# EAGLE design HackRPI-Badge (EAGLE 7.6.0)
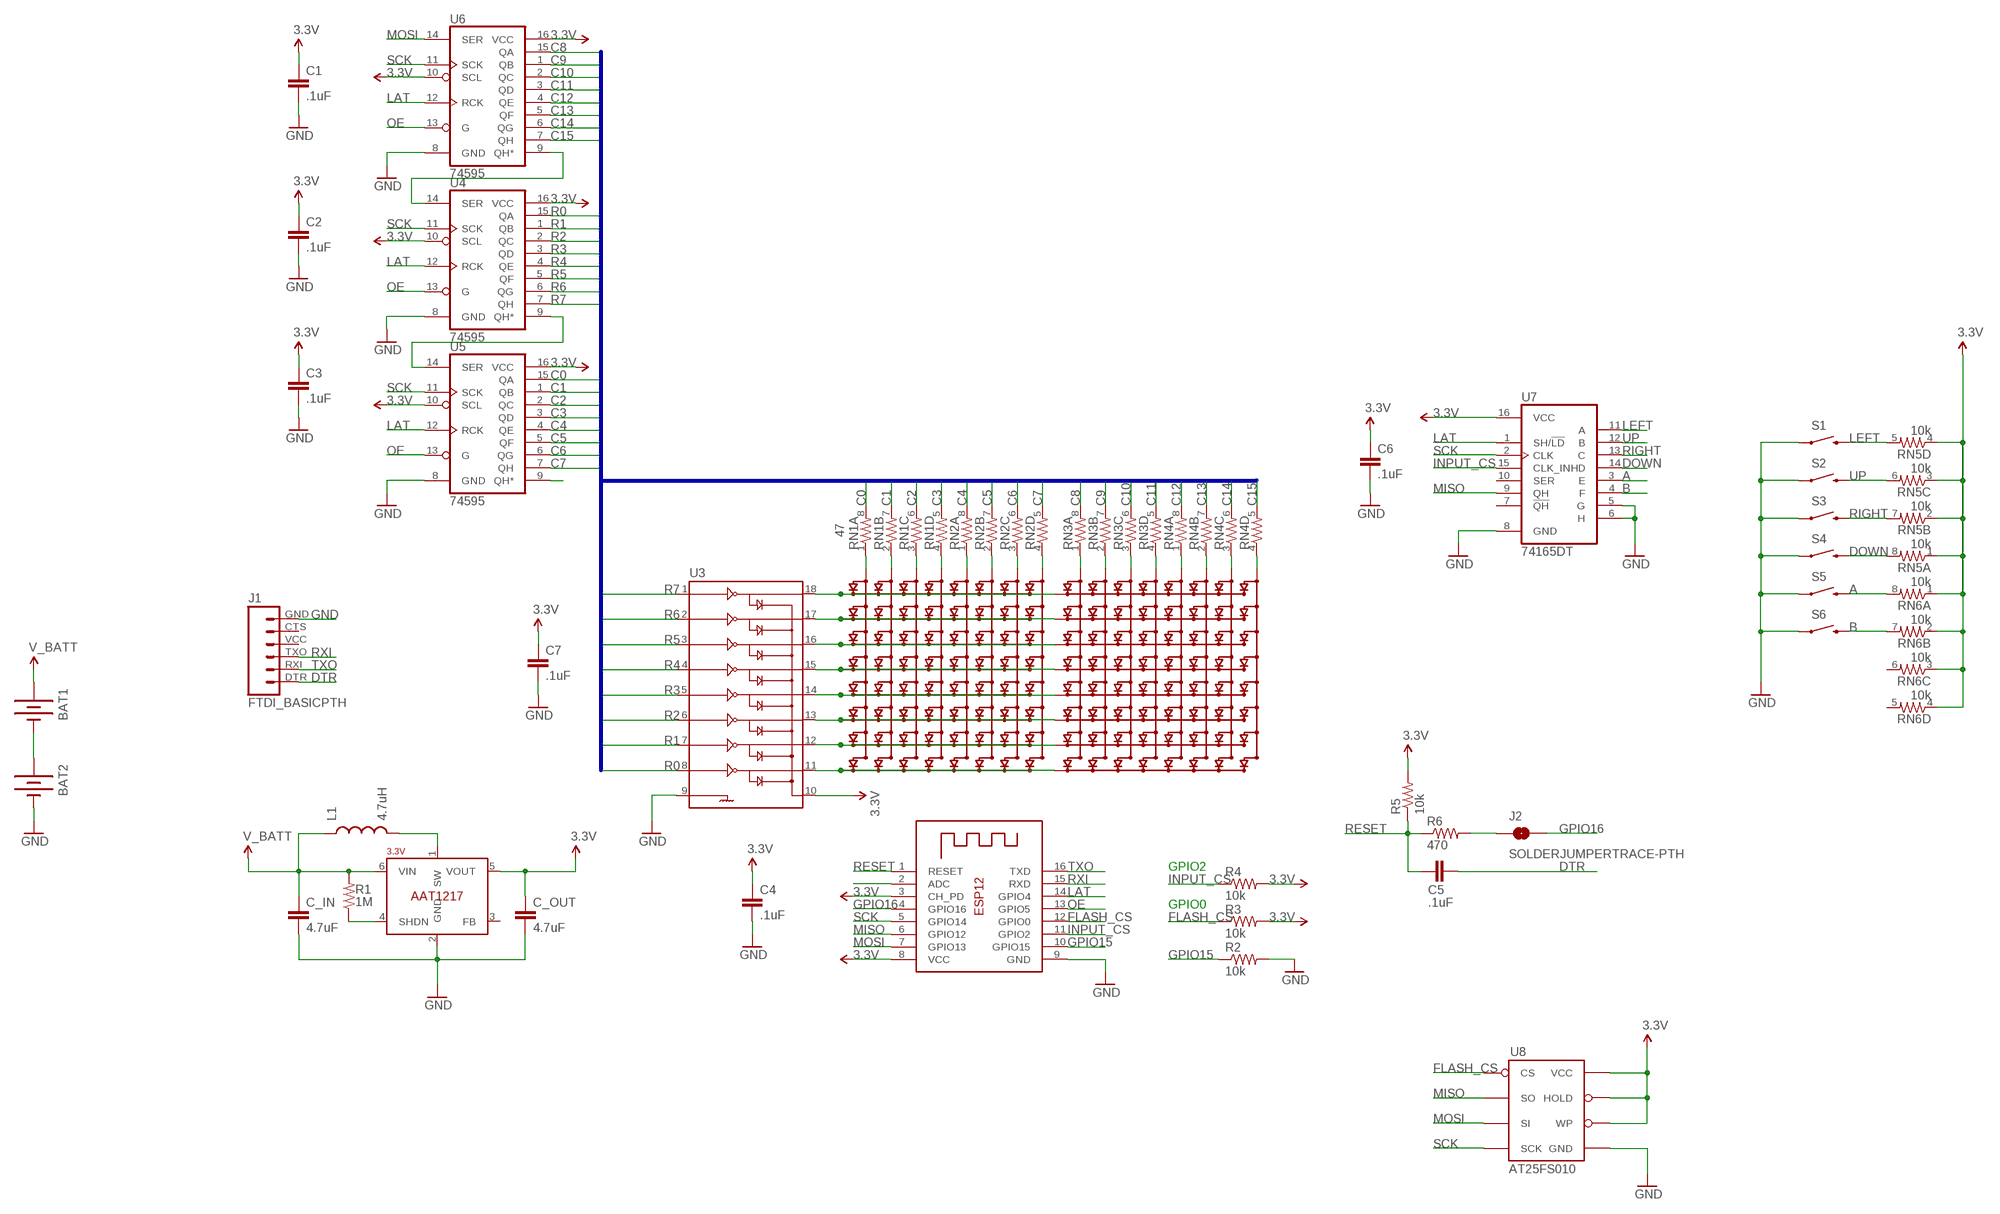
[diagram p0: schematic, sheet 1]

## Parts
BAT1  BATTERYAAA  [BATTERY-AAA]
BAT2  BATTERYAAA  [BATTERY-AAA]
C1  .1uF  CAP0603-CAP  [0603-CAP]
C2  .1uF  CAP0603-CAP  [0603-CAP]
C3  .1uF  CAP0603-CAP  [0603-CAP]
C4  .1uF  CAP0603-CAP  [0603-CAP]
C5  .1uF  CAP0603-CAP  [0603-CAP]
C6  .1uF  CAP0603-CAP  [0603-CAP]
C7  .1uF  CAP0603-CAP  [0603-CAP]
C_IN  4.7uF  CAP0805  [0805]
C_OUT  4.7uF  CAP0805  [0805]
J1  FTDI_BASICPTH  [FTDI_BASIC]
J2  SOLDERJUMPERTRACE-PTH  [SJ_2S-TRACE-PTH]
L1  4.7uH  INDUCTOR1007  [1007]
LED_LEFT  8X8LEDMATRIX_COLUMN_CATHODELDM-13488MI  [32MM_LEDMATRIX]
LEF_RIGHT  8X8LEDMATRIX_COLUMN_CATHODELDM-13488MI  [32MM_LEDMATRIX]
R1  1M  RESISTOR0603  [0603-RES]
R2  10k  RESISTOR0603  [0603-RES]
R3  10k  RESISTOR0603  [0603-RES]
R4  10k  RESISTOR0603  [0603-RES]
R5  10k  RESISTOR0603  [0603-RES]
R6  470  RESISTOR0603  [0603-RES]
RN1  47  RESISTOR-ARRAY0603-ARV  [0603-ARV]
RN2  47  RESISTOR-ARRAY0603-ARV  [0603-ARV]
RN3  47  RESISTOR-ARRAY0603-ARV  [0603-ARV]
RN4  47  RESISTOR-ARRAY0603-ARV  [0603-ARV]
RN5  10k  RESISTOR-ARRAY0603-ARV  [0603-ARV]
RN6  10k  RESISTOR-ARRAY0603-ARV  [0603-ARV]
S1  SWITCH-MOMENTARY-2PTH  [TACTILE-PTH]
S2  SWITCH-MOMENTARY-2PTH  [TACTILE-PTH]
S3  SWITCH-MOMENTARY-2PTH  [TACTILE-PTH]
S4  SWITCH-MOMENTARY-2PTH  [TACTILE-PTH]
S5  SWITCH-MOMENTARY-2PTH  [TACTILE-PTH]
S6  SWITCH-MOMENTARY-2PTH  [TACTILE-PTH]
U1  ESP-12  [ESP-12]
U2  3.3V  AAT1217  [SOT23-6]
U3  ULN2803SOICW  [SO18L]
U4  74595  [TSSOP16]
U5  74595  [TSSOP16]
U6  74595  [TSSOP16]
U7  74165DT  [TSSOP16]
U8  AT25FS010  [SO08WIDE]

## Nets
3.3V [power]: C1.1 C2.1 C3.1 C4.1 C6.1 C7.1 C_OUT.1 R3.2 R4.2 R5.2 RN5.1 RN5.2 RN5.3 RN5.4 RN6.1 RN6.2 RN6.3 RN6.4 U1.3(CH_PD) U1.8(VCC) U2.5(VOUT) U3.10 U4.10(SCL) U4.16(VCC) U5.10(SCL) U5.16(VCC) U6.10(SCL) U6.16(VCC) U7.16(VCC) U8.3(WP) U8.7(HOLD) U8.8(VCC)
A: RN6.8 S5.3 U7.3(E)
B: RN6.7 S6.3 U7.4(F)
C0: RN1.8 U5.15(QA)
C1: RN1.7 U5.1(QB)
C2: RN1.6 U5.2(QC)
C3: RN1.5 U5.3(QD)
C4: RN2.8 U5.4(QE)
C5: RN2.7 U5.5(QF)
C6: RN2.6 U5.6(QG)
C7: RN2.5 U5.7(QH)
C8: RN3.8 U6.15(QA)
C9: RN3.7 U6.1(QB)
C10: RN3.6 U6.2(QC)
C11: RN3.5 U6.3(QD)
C12: RN4.8 U6.4(QE)
C13: RN4.7 U6.5(QF)
C14: RN4.6 U6.6(QG)
C15: RN4.5 U6.7(QH)
DOWN: RN5.8 S4.3 U7.14(D)
DTR: C5.2 J1.DTR
FLASH_CS: R3.1 U1.12(GPIO0) U8.1(CS)
GND [power]: BAT2.GND@1(-) C1.2 C2.2 C3.2 C4.2 C6.2 C7.2 C_IN.2 C_OUT.2 J1.GND R2.2 S1.1 S2.1 S3.1 S4.1 S5.1 S6.1 U1.9(GND) U2.2(GND) U3.9 U4.8(GND) U5.8(GND) U6.8(GND) U7.5(G) U7.6(H) U7.8(GND) U8.4(GND)
GPIO15: R2.1 U1.10(GPIO15)
GPIO16: J2.2 U1.4(GPIO16)
INPUT_CS: R4.1 U1.11(GPIO2) U7.15(CLK_INH)
LAT: U1.14(GPIO4) U4.12(RCK) U5.12(RCK) U6.12(RCK) U7.1(SH/!LD)
LEFT: RN5.5 S1.3 U7.11(A)
MISO: U1.6(GPIO12) U7.9(QH) U8.2(SO)
MOSI: U1.7(GPIO13) U6.14(SER) U8.5(SI)
N$1: J2.1 R6.2
N$2: U1.2(ADC)
N$3: LED_LEFT.13(C1) RN1.1
N$4: LED_LEFT.3(C2) RN1.2
N$5 [power]: L1.2 U2.1(SW)
N$6: R1.1 U2.4(SHDN)
N$7: LED_LEFT.9(R1) LEF_RIGHT.9(R1) U3.18
N$8: LED_LEFT.4(C3) RN1.3
N$9: LED_LEFT.10(C4) RN1.4
N$10: LED_LEFT.6(C5) RN2.1
N$11: LED_LEFT.11(C6) RN2.2
N$12: LED_LEFT.15(C7) RN2.3
N$13: LED_LEFT.16(C8) RN2.4
N$14: LED_LEFT.14(R2) LEF_RIGHT.14(R2) U3.17
N$15: LED_LEFT.8(R3) LEF_RIGHT.8(R3) U3.16
N$16: LED_LEFT.12(R4) LEF_RIGHT.12(R4) U3.15
N$17: LED_LEFT.1(R5) LEF_RIGHT.1(R5) U3.14
N$18: LED_LEFT.7(R6) LEF_RIGHT.7(R6) U3.13
N$19: LED_LEFT.2(R7) LEF_RIGHT.2(R7) U3.12
N$20: LED_LEFT.5(R8) LEF_RIGHT.5(R8) U3.11
N$21: U4.9(QH*) U5.14(SER)
N$22: U4.14(SER) U6.9(QH*)
N$23: LEF_RIGHT.13(C1) RN3.1
N$24: LEF_RIGHT.3(C2) RN3.2
N$25: LEF_RIGHT.4(C3) RN3.3
N$26: LEF_RIGHT.10(C4) RN3.4
N$27: LEF_RIGHT.6(C5) RN4.1
N$28: LEF_RIGHT.11(C6) RN4.2
N$29: LEF_RIGHT.15(C7) RN4.3
N$30: LEF_RIGHT.16(C8) RN4.4
N$31 [power]: BAT1.GND@1(-) BAT2.PWR@1(+)
N$33: U5.9(QH*)
OE: U1.13(GPIO5) U4.13(G) U5.13(G) U6.13(G)
R0: U3.8 U4.15(QA)
R1: U3.7 U4.1(QB)
R2: U3.6 U4.2(QC)
R3: U3.5 U4.3(QD)
R4: U3.4 U4.4(QE)
R5: U3.3 U4.5(QF)
R6: U3.2 U4.6(QG)
R7: U3.1 U4.7(QH)
RESET: C5.1 R5.1 R6.1 U1.1(RESET)
RIGHT: RN5.7 S3.3 U7.13(C)
RXI: J1.TXO U1.15(RXD)
SCK: U1.5(GPIO14) U4.11(SCK) U5.11(SCK) U6.11(SCK) U7.2(CLK) U8.6(SCK)
TXO: J1.RXI U1.16(TXD)
UP: RN5.6 S2.3 U7.12(B)
V_BATT [power]: BAT1.PWR@1(+) C_IN.1 L1.1 R1.2 U2.6(VIN)
Unconnected: J1.CTS J1.VCC RN6.5 RN6.6 U2.3(FB) U7.7(!QH) U7.10(SER)

## Buses
R[0..7],C[0..15]

## Notes on the sheet
- GPIO2
- GPIO0

## Library data of the parts
BAT1 BAT2 = SparkFun-Electromechanical:BATTERY: Battery Holders Various common sizes : AA, AAA, 18650 (PRT-12895), 20mm coin cell and 12mm coin cell. 20MM_4LEGS, BATT-10373; PROD_ID: BATT-08571
C1-C7 C_IN C_OUT = SparkFun-Capacitors:CAP: Capacitor Standard 0603 ceramic capacitor, and 0.1" leaded capacitor.
J1 = SparkFun-Connectors:FTDI_BASIC: FTDI Basic header with labels
J2 = SparkFun-Retired:SOLDERJUMPER: Solder Jumper Standard SMD solder jumper. Used to automate production. Two varients : Normally Open and Normally Closed are the same, but have different paste layers. NC will have a large amount of paste and should jumper during reflow.
L1 = SparkFun-Passives:INDUCTOR: Inductors Basic Inductor/Choke - 0603 and 1206. Footprints are not proven and vary greatly between part numbers. INDUCTOR POWER 3.3UH 4.0A SMD 0.197" L x 0.197" W x 0.177" H (5.00mm x 5.00mm x 4.50mm)
LED_LEFT LEF_RIGHT = mylib:8X8LEDMATRIX_COLUMN_CATHODE
R1-R6 = SparkFun-Resistors:RESISTOR: Resistor Basic schematic elements and footprints for 0603, 1206, and PTH resistors.
RN1-RN6 = SparkFun-Passives:RESISTOR-ARRAY: Array Chip Resistor Source: RS Component / Phycomp
S1-S6 = SparkFun-Electromechanical:SWITCH-MOMENTARY-2: Various NO switches- pushbuttons, reed, etc; PROD_ID: SWCH-08441
U1 = adafruit:ESP-12
U2 = mylib:AAT1217
U3 = SparkFun-PowerIC:ULN2803: Darlington Driver ULN2803 Darlington array. 500mA max per channel, 8-channel package. Spark Fun Electronics SKU : COM-00312
U4-U6 = SparkFun-DigitalIC:74*595: 8-bit SHIFT REGISTER, output latch
U7 = mylib:74*165
U8 = SparkFun-DigitalIC:AT25FS010: 1-Mbit SPI flash memory

## Net classes
0 default: width 0.406 mm
1 power: width 0.508 mm

## Board
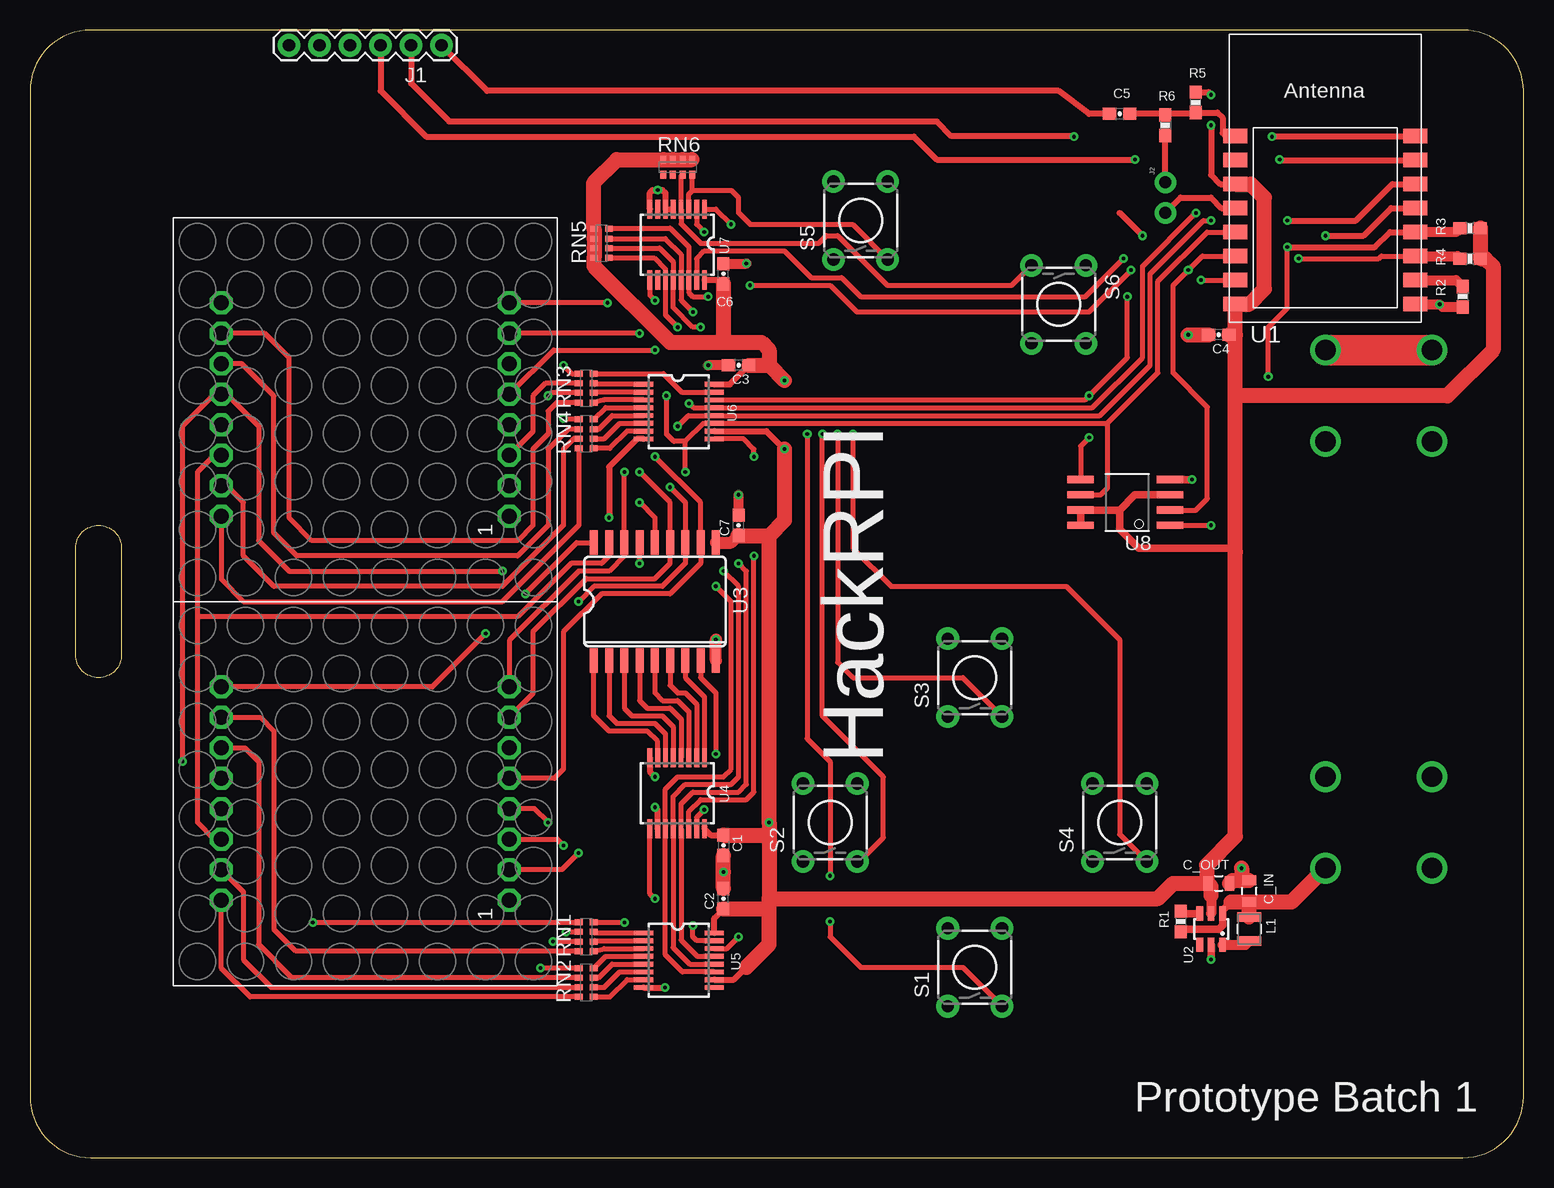
[diagram p1: board, top side]
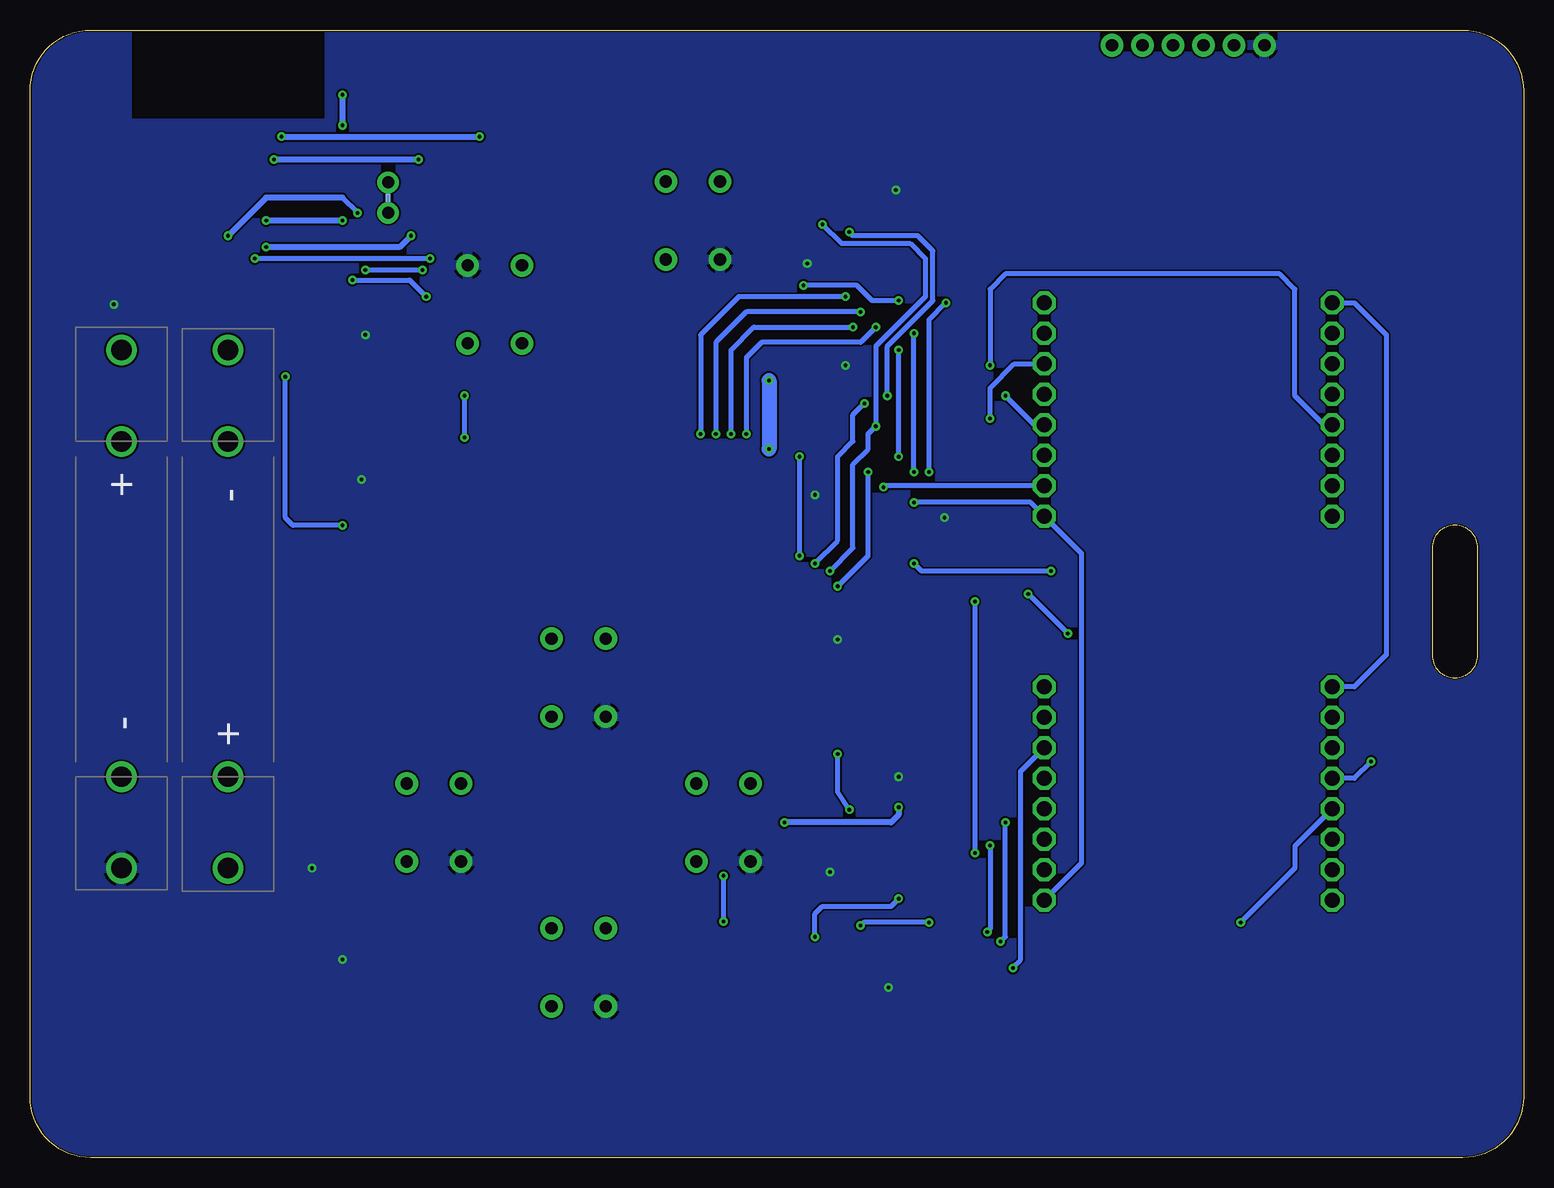
[diagram p2: board, bottom side, seen from below]

Size 124.46 x 93.98 mm. Coordinates in mm from the lower left corner, seen from the top.
Outline: 0,5.08 arc90 5.08,0 119.38,0 arc90 124.46,5.08 124.46,88.9 arc90 119.38,93.98 5.08,93.98 arc90 0,88.9 0,5.08
Outline: 7.62,50.8 7.62,41.91 arc-180 3.81,41.91 3.81,50.8 arc-180 7.62,50.8
Copper layers (1*16): Top 0.035mm / dielectric 1.5mm / Bottom 0.035mm
Design rules "pcbway *": minimum track width 6mil, minimum drill 12mil, track to track 6mil, track to pad 6mil, pad to pad 6mil, via to via 6mil, smd to smd 6mil, copper to edge 6mil, drill to drill 6mil, minimum pad ring 10mil, minimum via ring 8mil, stop-mask expansion 4mil, vias tented up to drill 0mil, thermal gap 10mil

### Footprints (pad centres in the part's own frame; a part is rotated, then mirrored left to right if it is on the bottom)
BATTERY-AAA = drill 1.702: GND@1 21.59,0; GND@2 13.97,0; PWR@1 -21.59,0; PWR@2 -13.97,0
0603-CAP = smd 1.1 x 1: 1 -0.85,0; 2 0.85,0
0805 = smd 0.8 x 1.2: 1 -0.9,0; 2 0.9,0
FTDI_BASIC = drill 1.016 pad 1.88: CTS 10.16,0; DTR 0,0; GND 12.7,0; RXI 2.54,0; TXO 5.08,0; VCC 7.62,0
SJ_2S-TRACE-PTH = drill 1.016 pad 1.778: 1 -1.27,0; 2 1.27,0 | smd 1.27 x 0.381 bottom: P$1 0,0
1007 = smd 2 x 0.8: 1 0,1; 2 0,-1
32MM_LEDMATRIX = drill 1.27 octagon: 1 -8.89,-12; 2 -6.35,-12; 3 -3.81,-12; 4 -1.27,-12; 5 1.27,-12; 6 3.81,-12; 7 6.35,-12; 8 8.89,-12; 9 8.89,12; 10 6.35,12; 11 3.81,12; 12 1.27,12; 13 -1.27,12; 14 -3.81,12; 15 -6.35,12; 16 -8.89,12
0603-RES = smd 1.1 x 1: 1 -0.85,0; 2 0.85,0
0603-ARV = smd 0.5 x 0.65: 1 -1.2,-0.625; 2 -0.4,-0.625; 3 0.4,-0.625; 4 1.2,-0.625; 5 1.2,0.625; 6 0.4,0.625; 7 -0.4,0.625; 8 -1.2,0.625
TACTILE-PTH = drill 1.016 pad 1.88: 1 -3.251,2.261; 2 3.251,2.261; 3 -3.251,-2.261; 4 3.251,-2.261
ESP-12 = smd 2 x 1.2: 1 -7.5,4.5; 2 -7.5,2.5; 3 -7.5,0.5; 4 -7.5,-1.5; 5 -7.5,-3.5; 6 -7.5,-5.5; 7 -7.5,-7.5; 8 -7.5,-9.5; 9 7.5,-9.5; 10 7.5,-7.5; 11 7.5,-5.5; 12 7.5,-3.5; 13 7.5,-1.5; 14 7.5,0.5; 15 7.5,2.5; 16 7.5,4.5
SOT23-6 = smd 0.55 x 1.2: 1 0.95,-1.3; 2 0,-1.3; 3 -0.95,-1.3; 4 -0.95,1.3; 5 0,1.3; 6 0.95,1.3
SO18L = smd 0.66 x 2.032: 1 -0.635,-4.902; 2 0.635,-4.902; 3 1.905,-4.902; 4 3.175,-4.902; 5 4.445,-4.902; 6 5.715,-4.902; 7 6.985,-4.902; 8 8.255,-4.902; 9 9.525,-4.902; 10 9.525,4.902; 11 8.255,4.902; 12 6.985,4.902; 13 5.715,4.902; 14 4.445,4.902; 15 3.175,4.902; 16 1.905,4.902; 17 0.635,4.902; 18 -0.635,4.902
TSSOP16 = smd 0.4 x 1.6: 1 -2.225,-2.85; 2 -1.575,-2.85; 3 -0.925,-2.85; 4 -0.275,-2.85; 5 0.375,-2.85; 6 1.025,-2.85; 7 1.675,-2.85; 8 2.325,-2.85; 9 2.325,3.05; 10 1.675,3.05; 11 1.025,3.05; 12 0.375,3.05; 13 -0.275,3.05; 14 -0.925,3.05; 15 -1.575,3.05; 16 -2.225,3.05
SO08WIDE = smd 0.61 x 2.21: 1 -1.905,-3.569; 2 -0.635,-3.569; 3 0.635,-3.569; 4 1.905,-3.569; 5 1.905,3.886; 6 0.635,3.886; 7 -0.635,3.886; 8 -1.905,3.886

### Placement (x,y rotation side)
BAT1  107.95,45.72 90 bottom
BAT2  116.84,45.72 270 bottom
C1  57.78,26.04 270 top
C2  57.78,21.59 90 top
C3  59.05,66.04 180 top
C4  99.06,68.58 180 top
C5  90.81,87 180 top
C6  57.78,73.66 90 top
C7  59.05,52.7 90 top
C_IN  101.6,22.23 90 top
C_OUT  99.06,22.86 0 top
J1  34.29,92.71 180 top
J2  94.61,80.01 270 top
L1  101.6,19.05 0 top
LED_LEFT  27.94,30.36 90 top
LEF_RIGHT  27.94,62.35 90 top
R1  95.89,19.68 270 top
R2  119.38,71.75 270 top
R3  120.02,77.47 0 top
R4  120.02,74.93 0 top
R5  97.16,87.95 90 top
R6  94.61,86.04 270 top
RN1  46.35,18.41 270 top
RN2  46.35,14.61 270 top
RN3  46.35,64.14 270 top
RN4  46.35,60.33 270 top
RN5  47.62,76.2 270 top
RN6  53.98,82.55 180 top
S1  78.74,15.88 90 top
S2  66.67,27.94 90 top
S3  78.74,40.01 90 top
S4  90.81,27.94 90 top
S5  69.22,78.11 90 top
S6  85.72,71.12 270 top
U1  107.95,80.64 0 top
U2  98.42,19.05 0 top
U3  47.62,46.35 0 top
U4  53.98,30.48 180 top
U5  53.98,16.51 270 top
U6  53.98,62.23 270 top
U7  53.98,76.2 180 top
U8  91.44,54.61 90 top

### Tracks (layer width: path | path; a pad name or v marks a point on that pad's centre or on a via)
3.3V  (via drill 0.3)
  Top 0.508: U6.16 58.32,64.45 C3.1 | U5.10 58.65,14.84 59.69,15.88 | RN5.1 | RN5.4 | U7.16 57.45,73.15 C6.1 | C1.1 56.74,26.89 U4.16 56.2,27.62 | U5.16 57.02,19.98 C2.1 | U4.10 52.3,28.98 v52.07,29.21 | R5.2 98.21,88.8 v98.42,88.58 | v98.42,86.04 98.42,81.92 99.19,81.14 U1.3 | U6.10 61.37,60.55 v62.87,59.05
  Top 0.61: U8.8 U8.7 90.81,53.98 | U8.3 92.08,55.24 90.81,53.98 | 90.81,53.98 90.81,52.39 92.39,50.8 100.45,50.8 100.45,50.48
  Top 0.813: 98.42,21.86 U2.5
  Top 1.016: U3.10 58.42,51.26 59.02,51.85
  Top 1.27: 100.45,63.5 100.45,50.48 100.45,26.79 98.06,24.39 98.06,22.86 C_OUT.1 | 100.45,63.5 100.45,68.58 | 100.45,68.58 U1.8 101.62,71.14 102.87,72.39 102.87,80.01 101.73,81.14 U1.3 | C4.1 100.45,68.58 | RN5.1 46.99,81.28 48.88,83.17 RN6.4 RN6.3 RN6.2 RN6.1 | RN5.1 RN5.2 RN5.3 RN5.4 | RN5.4 46.99,74.3 53.34,67.94 57.78,67.94 | C6.1 57.78,67.94 | 57.78,67.94 60.96,67.94 61.59,67.31 61.59,66.04 | 61.59,66.04 v62.87,64.77 | v62.87,59.05 62.87,53.12 61.59,51.85 | 59.02,51.85 C7.1 61.59,51.85 | C1.1 61.38,26.89 61.59,26.67 | 61.59,51.85 v61.59,27.94 61.59,26.67 | 59.69,15.88 61.59,17.78 61.59,20.74 | 61.59,20.74 61.59,21.59 | C2.1 61.59,20.74 | C3.1 61.59,66.04 | 98.42,21.86 98.42,22.59 C_OUT.1 | 61.59,21.59 93.98,21.59 95.25,22.86 C_OUT.1 | 61.59,26.67 61.59,21.59 | 100.45,63.5 118.11,63.5 121.92,67.31 121.92,74.3 121.28,74.93 R4.2 R3.2
  Bottom 0.508: v52.07,29.21 52.07,28.57 52.7,27.94 v61.59,27.94 | v98.42,88.58 v98.42,86.04
  Bottom 1.27: v62.87,64.77 v62.87,59.05
A
  Top 0.406: 55.17,80.58 54.9,80.3 U7.3 54.9,78.45 | 55.17,80.58 RN6.8 | S5.3 68.54,77.79 60.01,77.79 59.05,78.74 59.05,80.01 58.49,80.58 55.17,80.58
B
  Top 0.406: RN6.7 54.25,81.8 U7.4 54.25,77.83 55.88,76.2 65.72,76.2 66.36,76.83 67.31,76.83 71.44,72.71 81.8,72.71 S6.3
C0  (via drill 0.3)
  Top 0.406: RN1.8 v49.53,19.61 | U5.15 55.58,18.09 55.24,18.41 v55.24,19.36
  Bottom 0.406: v49.53,19.61 54.98,19.61 v55.24,19.36
C1
  Top 0.406: RN1.7 47.06,18.73 U5.1
C2
  Top 0.406: RN1.6 47.05,18.09 U5.2
C3
  Top 0.406: U5.3 47.84,17.43 RN1.5
C4
  Top 0.406: U5.4 47.96,16.79 RN2.8
C5
  Top 0.406: U5.5 48.52,16.14 47.39,15.01 RN2.7
C6
  Top 0.406: RN2.6 47.86,14.21 49.14,15.48 U5.6
C7
  Top 0.406: RN2.5 48.33,13.4 49.76,14.84 U5.7
C8
  Top 0.406: RN3.8 52.77,65.33 54.3,63.8 U6.15
C9
  Top 0.406: U6.1 47.06,64.45 RN3.7
C10
  Top 0.406: U6.2 47.05,63.8 RN3.6
C11
  Top 0.406: U6.3 47.84,63.16 RN3.5
C12
  Top 0.406: RN4.8 47.96,62.51 U6.4
C13
  Top 0.406: U6.5 48.52,61.85 47.39,60.73 RN4.7
C14
  Top 0.406: RN4.6 47.86,59.92 49.14,61.2 U6.6
C15
  Top 0.406: U6.7 49.76,60.55 48.33,59.12 RN4.5
DOWN  (via drill 0.3)
  Top 0.406: RN5.8 48.32,77.47 53.34,77.47 54.9,75.91 U7.14 54.9,72.1 55.24,71.75 v56.52,71.75 | v68.58,60.33 68.58,50.8 71.75,47.62 86.36,47.62 90.81,43.18 90.81,26.95 S4.3
  Bottom 0.406: v56.52,71.75 65.41,71.75 68.58,68.58 v68.58,60.33
DTR
  Top 0.508: C5.2 88.27,87 85.72,88.9 38.1,88.9 J1.DTR
FLASH_CS  (via drill 0.3)
  Top 0.406: U8.1 v98.42,52.7 | v103.19,65.09 103.19,69.22 104.78,70.8 v104.78,75.88
  Top 0.508: 90.81,78.74 v92.71,76.83 | v104.78,75.88 112.08,75.88 113.34,77.14 U1.12
  Top 0.813: R3.1 118.84,77.14 U1.12
  Bottom 0.406: 95.25,75.88 96.2,75.88 | v98.42,52.7 102.55,52.7 103.19,53.34 v103.19,65.09
  Bottom 0.508: v92.71,76.83 93.66,75.88 96.2,75.88 v104.78,75.88
GND  (via drill 0.3)
  Top 0.508: U5.8 v52.92,14.19 | U4.8 51.65,32.17 v52.07,31.75 | U6.8 50.59,59.91 48.26,57.58 v48.26,53.34 | U7.5 U7.6 52.95,80.4 52.7,80.64 v52.31,80.64 51.87,80.64 51.65,80.43 U7.8
  Top 0.61: U2.2 v98.42,16.51 | U8.4 v96.84,56.52
  Top 0.813: U1.9 115.47,71.12 v117.47,71.12 117.69,70.91 R2.2 | C7.2 v59.05,55.24 | C3.2 v56.52,66.04 | C6.2 v59.69,74.51
  Top 1.016: U3.9 v57.15,43.18 | 100.97,23.12 C_IN.2
  Top 1.27: v96.52,68.58 C4.2 | C1.2 v57.78,23.81 C2.2 | C_OUT.2 100.22,23.12 C_IN.2 | v100.97,24.13 100.97,23.12
  pour Bottom: 0,93.98 124.46,93.98 124.46,0 0,0
GPIO15
  Top 0.813: U1.10 118.84,73.14 R2.1
GPIO16
  Top 0.508: J2.2 95.89,80.01 98.42,80.01 99.29,79.14 U1.4
INPUT_CS  (via drill 0.3)
  Top 0.406: v91.12,74.93 87.95,71.75 69.22,71.75 67.63,73.34 65.09,73.34 62.87,75.56 56.2,75.56 55.55,74.92 U7.15 | v105.73,74.93 112.39,74.93 112.61,75.14 U1.11
  Top 0.813: U1.11 118.95,75.14 R4.1
  Bottom 0.406: v91.12,74.93 v105.73,74.93
LAT  (via drill 0.3)
  Top 0.406: U5.12 54.98,16.14 53.6,17.52 U4.12 53.6,30.11 54.61,31.11 58.42,31.11 59.05,31.75 59.05,47.62 v57.78,48.9 | v98.42,78.11 97.79,78.11 93.34,73.66 93.34,66.04 89.16,61.85 U6.12 54.87,61.85 v53.98,60.96 | U7.1 57.16,79.05 v58.42,77.79
  Top 0.508: v104.78,78.11 110.49,78.11 113.53,81.14 U1.14
  Bottom 0.406: v57.78,48.9 55.88,50.8 55.88,57.78 54.61,59.05 54.61,60.33 v53.98,60.96 53.98,67.63 49.85,71.75 49.85,74.93 51.12,76.2 56.83,76.2 v58.42,77.79
  Bottom 0.508: v98.42,78.11 v104.78,78.11
LEFT  (via drill 0.3)
  Top 0.406: RN5.5 52,75 52.95,74.05 U7.11 52.95,70.24 v53.98,69.22 | v64.77,60.33 64.77,34.92 66.67,33.02 v66.67,23.5 | v66.67,19.68 66.67,18.41 69.22,15.88 77.75,15.88 S1.3
  Bottom 0.406: v53.98,69.22 55.24,67.94 63.5,67.94 64.77,66.67 v64.77,60.33 | v66.67,23.5 v66.67,19.68
MISO  (via drill 0.3)
  Top 0.406: U7.9 51.65,71.86 v52.07,71.44 | v60.01,72.71 66.67,72.71 68.9,70.48 88.27,70.48 v91.76,73.98 | U1.6 97.69,75.14 v96.52,73.98 95.25,72.71 95.25,65.41 98.11,62.55 98.11,54.93 97.16,53.98 U8.2
  Bottom 0.406: v52.07,71.44 54.29,71.44 55.56,72.71 v60.01,72.71 | v91.76,73.98 v96.52,73.98
MOSI  (via drill 0.3)
  Top 0.406: U6.14 87.95,63.18 v88.27,63.5 91.44,66.67 v91.44,71.75 | v97.59,73.14 U1.7 | U8.5 87.55,59.3 v88.27,60.01
  Bottom 0.406: v91.44,71.75 92.83,73.14 v97.59,73.14 | v88.27,63.5 v88.27,60.01
N$1
  Top 0.508: J2.1 R6.2
N$3  (via drill 0.3)
  Top 0.406: v23.57,19.61 RN1.1
  Bottom 0.406: LED_LEFT.13 19.05,25.98 19.05,24.13 v23.57,19.61
N$4  (via drill 0.3)
  Top 0.406: LED_LEFT.3 43.94,26.55 v44.45,26.04 | v44.69,18.82 RN1.2
  Bottom 0.406: v44.45,26.04 44.45,19.05 v44.69,18.82
N$5
  Top 0.813: U2.1 101.3,17.75 L1.2
N$6
  Top 0.61: R1.1 96.07,20.35 U2.4
N$7  (via drill 0.3)
  Top 0.406: v37.98,43.69 33.53,39.24 LED_LEFT.9 | v41.27,46.99 45.54,51.26 U3.18
  Bottom 0.406: v37.98,43.69 v41.27,46.99 | LED_LEFT.9 14.1,39.24 11.43,41.91 11.43,68.58 14.1,71.25 LEF_RIGHT.9
N$8  (via drill 0.3)
  Top 0.406: RN1.3 v43.58,18.02 | v43.18,27.94 42.03,29.09 LED_LEFT.4
  Bottom 0.406: v43.58,18.02 43.18,18.41 v43.18,27.94
N$9
  Top 0.406: RN1.4 22.16,17.21 20.32,19.05 20.32,35.56 19.18,36.7 LED_LEFT.10
N$10  (via drill 0.3)
  Top 0.406: RN2.1 v42.55,15.8
  Bottom 0.406: v42.55,15.8 42.55,15.88 41.91,16.51 41.91,32.2 LED_LEFT.6
N$11
  Top 0.406: RN2.2 21.82,15.01 19.05,17.78 19.05,33.02 17.91,34.16 LED_LEFT.11
N$12
  Top 0.406: LED_LEFT.15 17.78,22.16 17.78,16.51 20.09,14.21 RN2.3
N$13
  Top 0.406: RN2.4 18.34,13.4 15.94,15.81 LED_LEFT.16
N$14
  Top 0.406: LED_LEFT.14 15.37,26.55 13.97,27.94 13.97,45.09 | 13.97,45.09 13.97,57.15 15.37,58.55 LEF_RIGHT.14 | U3.17 48.26,50.16 47.62,49.53 45.09,49.53 40.64,45.09 13.97,45.09
N$15  (via drill 0.3)
  Top 0.406: v49.53,57.15 U3.16 49.53,50.16 48.26,48.9 45.72,48.9 39.94,43.12 LED_LEFT.8 | v48.13,71.25 LEF_RIGHT.8
  Bottom 0.406: v49.53,57.15 49.53,69.85 v48.13,71.25
N$16  (via drill 0.3)
  Top 0.406: v12.7,33.02 12.7,60.96 15.37,63.62 LEF_RIGHT.12 16.39,63.62 19.05,60.96 19.05,51.44 21.59,48.9 v39.37,48.9 | v50.8,49.53 U3.15
  Bottom 0.406: v12.7,33.02 14.1,31.62 LED_LEFT.12 | v39.37,48.9 50.16,48.9 v50.8,49.53
N$17  (via drill 0.3)
  Top 0.406: v50.8,54.61 52.07,53.34 U3.14
  Bottom 0.406: LED_LEFT.1 36.83,24.57 36.83,50.35 LEF_RIGHT.1 41.09,54.61 v50.8,54.61
N$18  (via drill 0.3)
  Top 0.406: v50.8,57.15 53.34,54.61 U3.13 53.34,49.53 52.07,48.26 46.35,48.26 41.91,43.81 41.91,38.67 LED_LEFT.7 | v50.8,68.7 LEF_RIGHT.7
  Bottom 0.406: v50.8,57.15 v50.8,68.7
N$19  (via drill 0.3)
  Top 0.406: v53.34,55.88 54.61,54.61 U3.12 54.61,49.53 52.7,47.62 46.99,47.62 v45.72,46.35 | v45.72,25.4 44.33,24 LED_LEFT.2
  Bottom 0.406: LEF_RIGHT.2 53.22,56.01 v53.34,55.88 | v45.72,46.35 v45.72,25.4
N$20  (via drill 0.3)
  Top 0.406: v52.07,58.42 55.88,54.61 U3.11 55.88,49.53 53.34,46.99 47.62,46.99 44.45,43.81 44.45,32.38 43.69,31.62 LED_LEFT.5 | LEF_RIGHT.5 43.62,67.31 v52.07,67.31
  Bottom 0.406: v52.07,58.42 v52.07,67.31
N$21  (via drill 0.3)
  Top 0.406: v59.05,18.41 58.08,17.43 U5.14 | v52.07,21.59 51.65,22.01 U4.9
  Bottom 0.406: v59.05,18.41 59.05,20.32 58.42,20.95 52.7,20.95 v52.07,21.59
N$22  (via drill 0.3)
  Top 0.406: U4.14 54.9,28.86 55.88,29.84 59.69,29.84 60.33,30.48 v60.33,50.16 | v60.33,58.42 60.33,59.05 59.48,59.91 U6.9
  Bottom 0.406: v60.33,50.16 v60.33,58.42
N$23  (via drill 0.3)
  Top 0.406: v44.45,66.04 45.16,65.33 RN3.1
  Bottom 0.406: LEF_RIGHT.13 16.64,61.09 19.05,63.5 19.05,72.39 20.32,73.66 43.18,73.66 44.45,72.39 v44.45,66.04
N$24
  Top 0.406: RN3.2 42.95,64.53 41.91,63.5 41.91,60.52 LEF_RIGHT.3
N$25  (via drill 0.3)
  Top 0.406: RN3.3 43.41,63.73 v43.18,63.5
  Bottom 0.406: v43.18,63.5 40.77,61.09 LEF_RIGHT.4
N$26
  Top 0.406: RN3.4 43.88,62.94 43.18,62.23 43.18,60.33 41.91,59.05 41.91,52.7 40.64,51.44 23.5,51.44 21.59,53.34 21.59,66.67 19.56,68.7 LEF_RIGHT.10
N$27  (via drill 0.3)
  Top 0.406: RN4.1 44.52,61.52 v44.45,61.59
  Bottom 0.406: v44.45,61.59 44.45,64.14 42.42,66.17 LEF_RIGHT.6
N$28
  Top 0.406: RN4.2 44.85,60.73 43.18,59.05 43.18,52.7 40.64,50.16 22.23,50.16 20.32,52.07 20.32,63.5 17.66,66.17 LEF_RIGHT.11
N$29
  Top 0.406: RN4.3 45.32,59.92 44.45,59.05 44.45,52.7 39.37,47.62 20.32,47.62 17.78,50.16 17.78,54.61 16.39,56.01 LEF_RIGHT.15
N$30
  Top 0.406: LEF_RIGHT.16 15.94,48.2 17.78,46.35 39.37,46.35 45.73,52.72 RN4.4
N$31
  Top 2.54: BAT1.GND@1 BAT2.PWR@1
OE  (via drill 0.3)
  Top 0.406: U5.13 55.6,16.79 54.25,18.14 U4.13 54.25,29.48 55.24,30.48 59.05,30.48 59.69,31.11 59.69,48.9 v59.05,49.53 | v97.16,78.74 92.71,74.3 92.71,66.67 88.54,62.51 U6.13 55.29,62.51 v54.93,62.87
  Top 0.508: v107.95,76.83 111.12,76.83 113.44,79.14 U1.13
  Bottom 0.406: v97.16,78.74 98.42,80.01 | v59.05,49.53 57.15,51.44 57.15,58.42 55.88,59.69 55.88,61.91 v54.93,62.87
  Bottom 0.508: 98.42,80.01 104.78,80.01 v107.95,76.83
R0  (via drill 0.3)
  Top 0.406: U3.8 55.88,40.01 57.15,38.73 v57.15,33.66 | v56.19,29.01 55.55,28.37 U4.15
  Bottom 0.406: v56.19,29.01 57.15,30.48 v57.15,33.66
R1
  Top 0.406: U3.7 54.61,40.01 56.2,38.41 U4.1
R2
  Top 0.406: U3.6 53.34,39.37 53.98,38.73 54.61,38.73 55.55,37.8 U4.2
R3
  Top 0.406: U3.5 52.07,38.73 52.7,38.1 53.98,38.1 54.9,37.17 U4.3
R4
  Top 0.406: U3.4 50.8,38.1 51.44,37.47 53.34,37.47 54.25,36.55 U4.4
R5
  Top 0.406: U3.3 49.53,37.47 50.16,36.83 52.7,36.83 53.6,35.94 U4.5
R6
  Top 0.406: U3.2 48.26,36.83 48.9,36.2 52.07,36.2 52.95,35.31 U4.6
R7
  Top 0.406: U4.7 52.3,34.7 51.44,35.56 48.26,35.56 46.99,36.83 U3.1
RESET
  Top 0.508: U1.1 99.64,85.14 99.38,85.41 99.38,86.68 98.96,87.1 R5.1 97.05,87 94.61,87 | 94.61,87 C5.1 | R6.1 94.61,87
RIGHT  (via drill 0.3)
  Top 0.406: RN5.7 52.94,76.6 54.25,75.29 U7.13 54.25,71.48 v55.24,70.48 | v67.31,60.33 67.31,41.27 68.58,40.01 77.75,40.01 S3.3
  Bottom 0.406: v55.24,70.48 64.77,70.48 67.31,67.94 v67.31,60.33
RXI  (via drill 0.3)
  Top 0.508: J1.TXO 29.21,88.9 33.02,85.09 73.66,85.09 75.56,83.19 v92.08,83.19 | v104.14,83.19 104.18,83.14 U1.15
  Bottom 0.508: v92.08,83.19 v104.14,83.19
SCK  (via drill 0.3)
  Top 0.406: U5.11 54.37,15.48 52.95,16.9 U4.11 52.95,30.73 53.98,31.75 57.78,31.75 58.42,32.38 58.42,46.35 v57.15,47.62 | 89.78,61.2 U6.11 56.12,61.2 54.61,59.69 | 89.78,61.2 93.98,65.41 93.98,73.03 98.1,77.14 U1.5 | v54.61,57.15 54.61,59.69 | U8.6 89.22,55.24 89.78,55.81 89.78,61.2 | 54.61,59.69 53.66,59.69 53.02,60.33 v53.02,63.5 | 56.19,77.17 v56.19,77.14 55.55,77.78 U7.2
  Bottom 0.406: v57.15,47.62 54.61,50.16 v54.61,57.15 | v53.02,63.5 53.02,67.63 49.21,71.44 49.21,75.56 50.48,76.83 55.88,76.83 v56.19,77.14
TXO  (via drill 0.3)
  Top 0.508: J1.RXI 31.75,89.53 34.92,86.36 75.56,86.36 76.78,85.14 86.94,85.14 v87,85.09 | U1.16 115.39,85.09 v103.5,85.09
  Bottom 0.508: v103.5,85.09 v87,85.09
UP  (via drill 0.3)
  Top 0.406: RN5.6 52.47,75.8 53.6,74.67 U7.12 53.6,70.86 55.24,69.22 v55.88,69.22 | S2.3 69.14,24.69 71.12,26.67 71.12,31.75 66.04,36.83 v66.04,60.33
  Bottom 0.406: v66.04,60.33 66.04,67.31 64.14,69.22 v55.88,69.22
V_BATT
  Top 0.61: 100.06,21.32 99.38,20.64 U2.6 99.38,19.36 99.06,19.05 96.1,19.05 R1.2
  Top 1.27: C_IN.1 105.14,21.32 BAT1.PWR@1 | L1.1 C_IN.1 | 100.06,21.32 C_IN.1

### Text on the board
tPlace: HackRPI | Prototype Batch 1